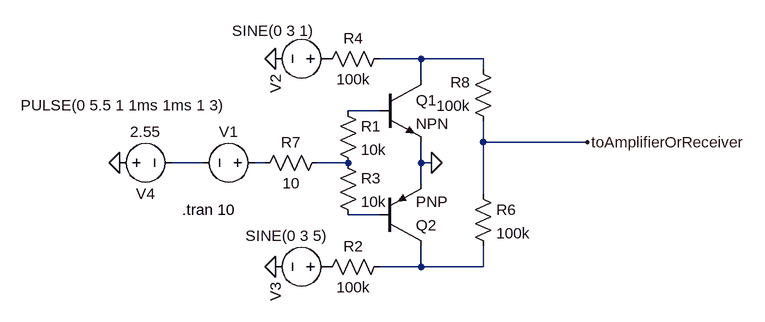
[diagram p0: schematic twooscilators.asc]
twooscilators.asc, the LTspice schematic file:
Version 4
SHEET 1 1008 680
WIRE 288 80 224 80
WIRE 384 80 288 80
WIRE 384 96 384 80
WIRE 288 112 288 80
WIRE 224 160 176 160
WIRE 384 208 384 176
WIRE 544 208 384 208
WIRE -48 240 -96 240
WIRE 48 240 32 240
WIRE 176 240 128 240
WIRE 288 240 288 208
WIRE 304 240 288 240
WIRE 288 272 288 240
WIRE 384 288 384 208
WIRE 224 320 176 320
WIRE 288 400 288 368
WIRE 288 400 224 400
WIRE 384 400 384 368
WIRE 384 400 288 400
FLAG 64 80 0
FLAG 64 400 0
FLAG -176 240 0
FLAG 544 208 toAmplifierOrReceiver
FLAG 304 240 0
SYMBOL voltage 48 240 R90
WINDOW 0 -32 56 VBottom 2
WINDOW 3 -73 219 VBottom 2
WINDOW 123 0 0 Left 0
WINDOW 39 0 0 Left 0
SYMATTR InstName V1
SYMATTR Value PULSE(0 5.5 1 1ms 1ms 1 3)
SYMBOL res 128 96 R270
WINDOW 0 32 56 VTop 2
WINDOW 3 0 56 VBottom 2
SYMATTR InstName R4
SYMATTR Value 100k
SYMBOL voltage 160 80 R90
WINDOW 0 24 96 Left 2
WINDOW 3 -43 37 VRight 2
WINDOW 123 0 0 Left 0
WINDOW 39 0 0 Left 0
SYMATTR InstName V2
SYMATTR Value SINE(0 3 1)
SYMBOL npn 224 112 R0
SYMATTR InstName Q1
SYMBOL res 128 416 R270
WINDOW 0 32 56 VTop 2
WINDOW 3 0 56 VBottom 2
SYMATTR InstName R2
SYMATTR Value 100k
SYMBOL voltage 160 400 R90
WINDOW 0 24 96 Left 2
WINDOW 3 -48 16 VRight 2
WINDOW 123 0 0 Left 0
WINDOW 39 0 0 Left 0
SYMATTR InstName V3
SYMATTR Value SINE(0 3 5)
SYMBOL pnp 224 368 M180
SYMATTR InstName Q2
SYMBOL res 160 144 R0
SYMATTR InstName R1
SYMATTR Value 10k
SYMBOL res 160 224 R0
SYMATTR InstName R3
SYMATTR Value 10k
SYMBOL voltage -192 240 R270
WINDOW 0 -32 56 VBottom 2
WINDOW 3 32 56 VTop 2
WINDOW 123 0 0 Left 0
WINDOW 39 0 0 Left 0
SYMATTR InstName V4
SYMATTR Value 2.55
SYMBOL res 144 224 R90
WINDOW 0 0 56 VBottom 2
WINDOW 3 32 56 VTop 2
SYMATTR InstName R7
SYMATTR Value 10
SYMBOL res 368 272 R0
SYMATTR InstName R6
SYMATTR Value 100k
SYMBOL res 400 192 R180
WINDOW 0 36 76 Left 2
WINDOW 3 36 40 Left 2
SYMATTR InstName R8
SYMATTR Value 100k
TEXT -80 312 Left 2 !.tran 10

The netlist it stands for:
* twooscilators.asc
V1 N004 N003 PULSE(0 5.5 1 1ms 1ms 1 3)
R4 P001 N001 100k
V2 P001 0 SINE(0 3 1)
Q1 N001 N002 0 0 NPN
R2 P002 N007 100k
V3 P002 0 SINE(0 3 5)
Q2 N007 N006 0 0 PNP
R1 N002 N005 10k
R3 N005 N006 10k
V4 0 N003 2.55
R7 N005 N004 10
R6 toAmplifierOrReceiver N007 100k
R8 toAmplifierOrReceiver N001 100k
.model NPN NPN
.model PNP PNP
.lib standard.bjt
.tran 10
.backanno
.end